# Altium schematic sheet Sheet_Block.SchDoc
size A4; SheetNumber: 2; SheetTotal: 2
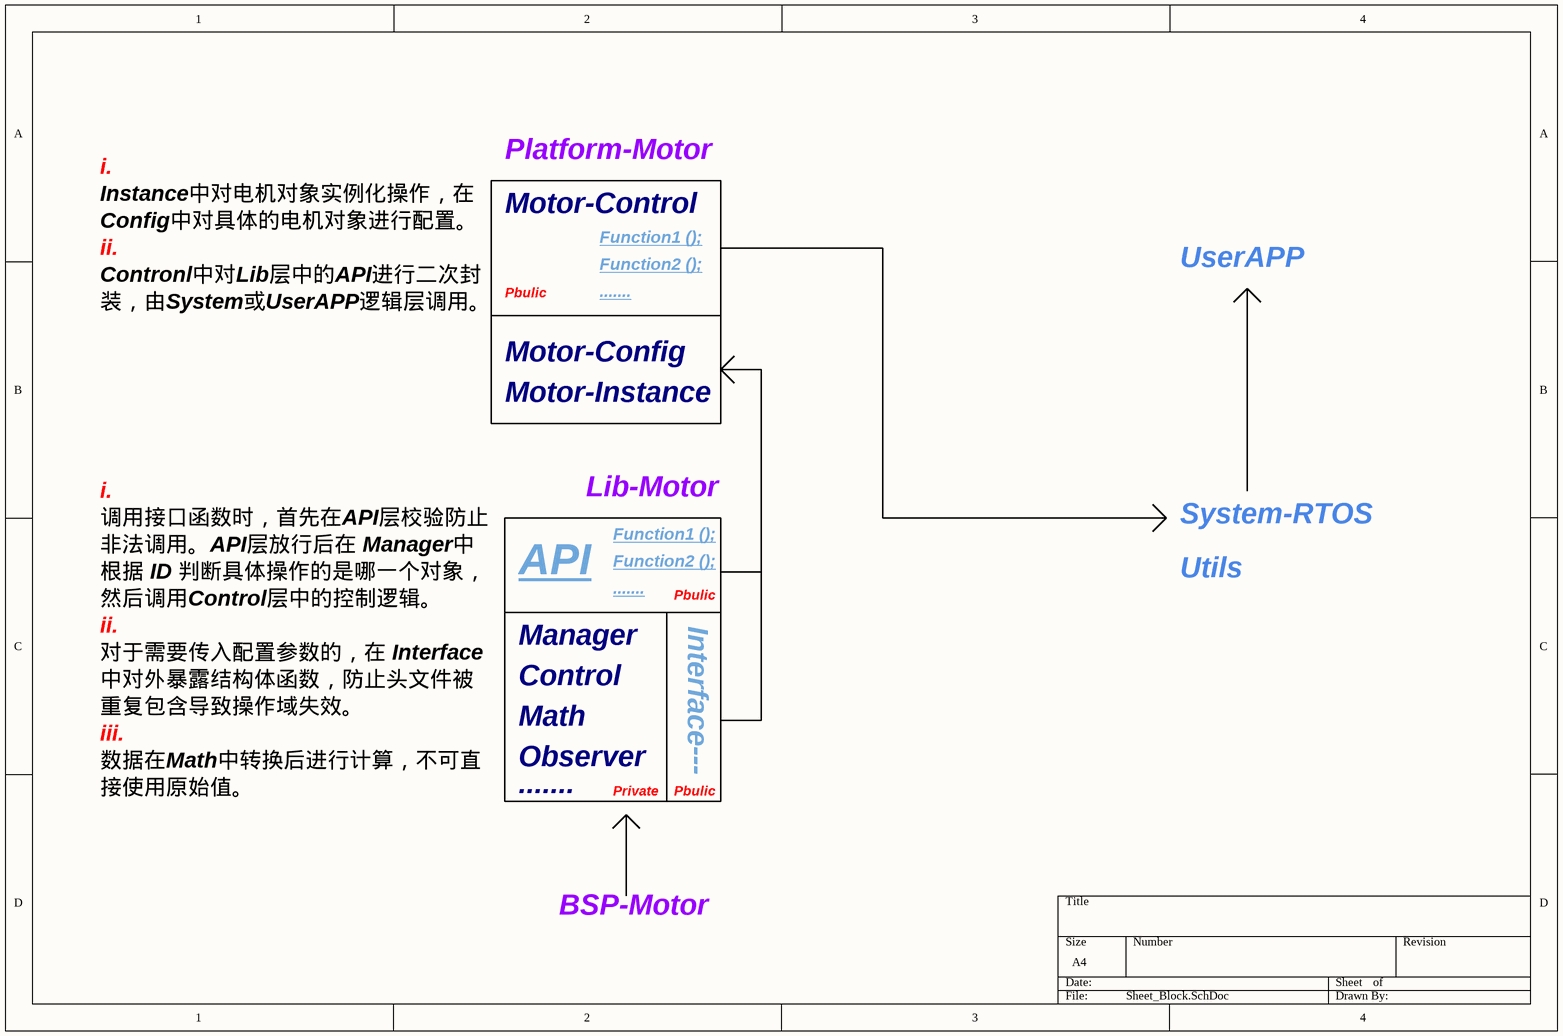
[diagram p0: Sheet_Block.SchDoc]

## Notes on the sheet
- i.
- Platform-Motor
- Instance中对电机对象实例化操作，在
- Config中对具体的电机对象进行配置。
- Motor-Control
- Function1 ();
- ii.
- Contronl中对Lib层中的API进行二次封
- 装，由System或UserAPP逻辑层调用。
- Pbulic
- Function2 ();
- .......
- UserAPP
- Motor-Config
- Motor-Instance
- Lib-Motor
- 调用接口函数时，首先在API层校验防止
- 非法调用。API层放行后在 Manager中
- 根据 ID 判断具体操作的是哪一个对象，
- API
- System-RTOS
- Utils
- 然后调用Control层中的控制逻辑。
- Manager
- Interface---
- 对于需要传入配置参数的，在 Interface
- 中对外暴露结构体函数，防止头文件被
- 重复包含导致操作域失效。
- Control
- iii.
- 数据在Math中转换后进行计算，不可直
- Math
- Observer
- 接使用原始值。
- Private
- BSP-Motor